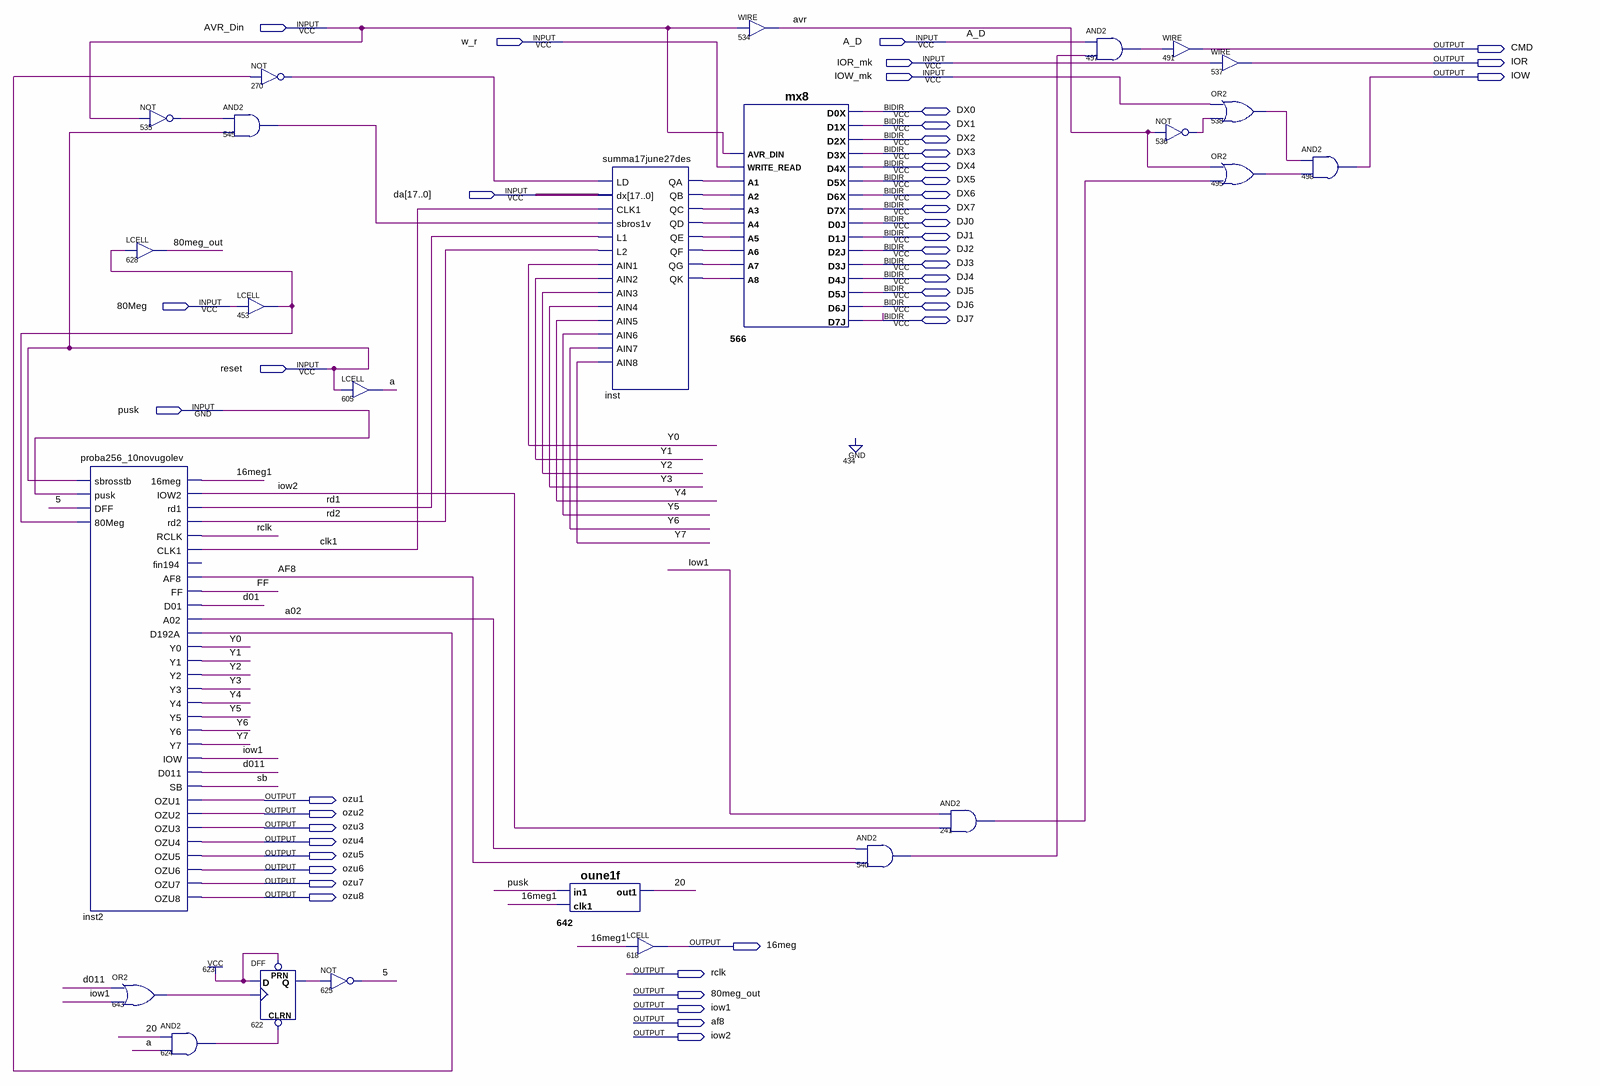
[diagram p0: schematic sheet]
// Quartus schematic prog256DES1_2018.bdf as structural Verilog: 25 symbols, 42 pins
module prog256DES1_2018 (
  input  AVR_Din,
  input  w_r,
  input  A_D,
  input  IOR_mk,
  input  IOW_mk,
  input  [17:0] da,
  input  \80Meg ,
  input  reset,
  input  pusk,
  inout  DX0,
  inout  DX1,
  inout  DX2,
  inout  DX3,
  inout  DX4,
  inout  DX5,
  inout  DX6,
  inout  DX7,
  inout  DJ0,
  inout  DJ1,
  inout  DJ2,
  inout  DJ3,
  inout  DJ4,
  inout  DJ5,
  inout  DJ6,
  inout  DJ7,
  output CMD,
  output IOR,
  output IOW,
  output ozu1,
  output ozu2,
  output ozu3,
  output ozu4,
  output ozu5,
  output ozu6,
  output ozu7,
  output ozu8,
  output \16meg ,
  output rclk,
  output \80meg_out ,
  output iow1,
  output af8,
  output iow2
);

  wire \5 , \16meg1 , \20 , a, a02, avr, clk1, d01, d011, FF, inst2_d192a, inst_qa, inst_qb, inst_qc,
       inst_qd, inst_qe, inst_qf, inst_qg, inst_qk, n241_out, n270_out, n453_out, n495_out, n497_out,
       n535_out, n536_out, n538_out, n540_out, n545_out, n622_q, n624_out, n643_out, rd1, rd2, sb, Y0, Y1,
       Y2, Y3, Y4, Y5, Y6, Y7;

  proba256_10novugolev inst2 (
    .sbrosstb(reset), .pusk(pusk), .DFF(\5 ), .\80Meg (n453_out), .\16meg (\16meg1 ), .IOW2(iow2), .rd1(rd1),
    .rd2(rd2), .RCLK(rclk), .CLK1(clk1), .AF8(af8), .FF(FF), .D01(d01), .A02(a02), .D192A(inst2_d192a),
    .Y0(Y0), .Y1(Y1), .Y2(Y2), .Y3(Y3), .Y4(Y4), .Y5(Y5), .Y6(Y6), .Y7(Y7), .IOW(iow1), .D011(d011), .SB(sb),
    .OZU1(ozu1), .OZU2(ozu2), .OZU3(ozu3), .OZU4(ozu4), .OZU5(ozu5), .OZU6(ozu6), .OZU7(ozu7), .OZU8(ozu8));  // open: fin194
  LCELL u_628 (.IN(n453_out), .OUT(\80meg_out ));
  or u_643 (n643_out, d011, iow1);
  not u_535 (n535_out, AVR_Din);
  and u_624 (n624_out, \20 , a);
  and u_545 (n545_out, n535_out, reset);
  LCELL u_453 (.IN(\80Meg ), .OUT(n453_out));
  not u_270 (n270_out, inst2_d192a);
  DFF u_622 (.CLRN(n624_out), .CLK(n643_out), .D(1'b1), .PRN(1'b1), .Q(n622_q));
  LCELL u_605 (.IN(reset), .OUT(a));
  not u_625 (\5 , n622_q);
  oune1f u_642 (.in1(pusk), .clk1(\16meg1 ), .out1(\20 ));
  summa17june27des inst (
    .LD(n270_out), .dx(da), .CLK1(clk1), .sbros1v(n545_out), .L1(rd1), .L2(rd2), .AIN1(Y0), .AIN2(Y1),
    .AIN3(Y2), .AIN4(Y3), .AIN5(Y4), .AIN6(Y5), .AIN7(Y6), .AIN8(Y7), .QA(inst_qa), .QB(inst_qb),
    .QC(inst_qc), .QD(inst_qd), .QE(inst_qe), .QF(inst_qf), .QG(inst_qg), .QK(inst_qk));
  LCELL u_618 (.IN(\16meg1 ), .OUT(\16meg ));
  assign avr = AVR_Din;  // WIRE 534
  mx8 u_566 (
    .AVR_DIN(AVR_Din), .WRITE_READ(w_r), .A1(inst_qa), .A2(inst_qb), .A3(inst_qc), .A4(inst_qd),
    .A5(inst_qe), .A6(inst_qf), .A7(inst_qg), .A8(inst_qk), .D0X(DX0), .D1X(DX1), .D2X(DX2), .D3X(DX3),
    .D4X(DX4), .D5X(DX5), .D6X(DX6), .D7X(DX7), .D0J(DJ0), .D1J(DJ1), .D2J(DJ2), .D3J(DJ3), .D4J(DJ4),
    .D5J(DJ5), .D6J(DJ6), .D7J(DJ7));
  and u_540 (n540_out, a02, af8);
  and u_241 (n241_out, iow1, iow2);
  and u_497 (n497_out, A_D, n540_out);
  assign CMD = n497_out;  // WIRE 491
  not u_536 (n536_out, avr);
  assign IOR = IOR_mk;  // WIRE 537
  or u_538 (n538_out, IOW_mk, n536_out);
  or u_495 (n495_out, avr, n241_out);
  and u_498 (IOW, n538_out, n495_out);
endmodule
